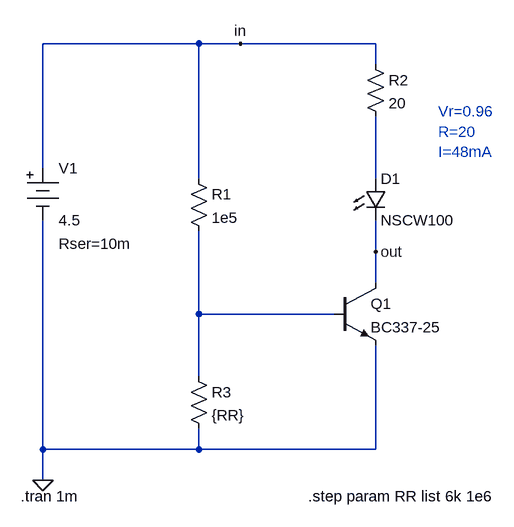
[diagram p0: schematic Draft1.asc]
Draft1.asc, the LTspice schematic file:
Version 4
SHEET 1 880 680
WIRE 48 -112 -192 -112
WIRE 112 -112 48 -112
WIRE 320 -112 112 -112
WIRE 320 -80 320 -112
WIRE -192 80 -192 -112
WIRE 48 96 48 -112
WIRE 320 96 320 0
WIRE 320 208 320 160
WIRE 320 256 320 208
WIRE 48 304 48 176
WIRE 256 304 48 304
WIRE 48 400 48 304
WIRE -192 512 -192 160
WIRE 48 512 48 480
WIRE 48 512 -192 512
WIRE 320 512 320 352
WIRE 320 512 48 512
WIRE -192 560 -192 512
FLAG -192 560 0
FLAG 112 -112 in
FLAG 320 208 out
SYMBOL Misc\\battery -192 64 R0
WINDOW 123 0 0 Left 0
WINDOW 39 24 132 Left 2
SYMATTR InstName V1
SYMATTR Value 4.5
SYMATTR SpiceLine Rser=10m
SYMBOL npn 256 256 R0
SYMATTR InstName Q1
SYMATTR Value BC337-25
SYMBOL res 304 -96 R0
SYMATTR InstName R2
SYMATTR Value 20
SYMBOL LED 304 96 R0
SYMATTR InstName D1
SYMATTR Value NSCW100
SYMBOL res 32 384 R0
SYMATTR InstName R3
SYMATTR Value {RR}
SYMBOL res 32 80 R0
SYMATTR InstName R1
SYMATTR Value 1e5
TEXT -226 584 Left 2 !.tran 1m
TEXT 416 -8 Left 2 ;Vr=0.96\nR=20\nI=48mA
TEXT 216 584 Left 2 !.step param RR list 6k 1e6

The netlist it stands for:
* Draft1.asc
V1 in 0 4.5 Rser=10m
Q1 out N002 0 0 BC337-25
R2 in N001 20
D1 N001 out NSCW100
R3 N002 0 {RR}
R1 in N002 1e5
.model D D
.lib standard.dio
.model NPN NPN
.model PNP PNP
.lib standard.bjt
.tran 1m
* Vr=0.96
* R=20
* I=48mA
.step param RR list 6k 1e6
.backanno
.end